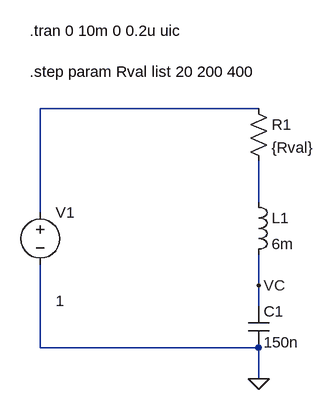
[diagram p0: schematic RLCSim.asc]
RLCSim.asc, the LTspice schematic file:
Version 4.1
SHEET 1 880 788
WIRE 416 -64 80 -64
WIRE 416 80 416 16
WIRE 80 96 80 -64
WIRE 416 208 416 160
WIRE 416 240 416 208
WIRE 80 304 80 176
WIRE 416 304 80 304
WIRE 416 352 416 304
FLAG 416 352 0
FLAG 416 208 VC
SYMBOL voltage 80 80 R0
WINDOW 3 24 152 Left 2
WINDOW 123 24 124 Left 2
WINDOW 39 0 0 Left 0
SYMATTR InstName V1
SYMATTR Value 1
SYMBOL res 400 -80 R0
SYMATTR InstName R1
SYMATTR Value {Rval}
SYMBOL ind 400 64 R0
SYMATTR InstName L1
SYMATTR Value 6m
SYMBOL cap 400 240 R0
SYMATTR InstName C1
SYMATTR Value 150n
TEXT 64 -184 Left 2 !.tran 0 10m 0 0.2u uic\n \n.step param Rval list 20 200 400

The netlist it stands for:
* RLCSim.asc
V1 N001 0 1
R1 N001 N002 {Rval}
L1 N002 VC 6m
C1 VC 0 150n
.tran 0 10m 0 0.2u uic
.step param Rval list 20 200 400
.backanno
.end